# Altium schematic sheet EDU_High-Speed-Design_Power_3V0.SchDoc: 3V0
size 279 x 215 mm; Date: not used; ApprovedBy: not used; CheckedBy: not used; Author: not used; DrawnBy: not used; Organization: not used; Address4: not used; SheetNumber: 4; SheetTotal: 26; Time: not used; ImagePath: not used; Application_BuildNumber: not used
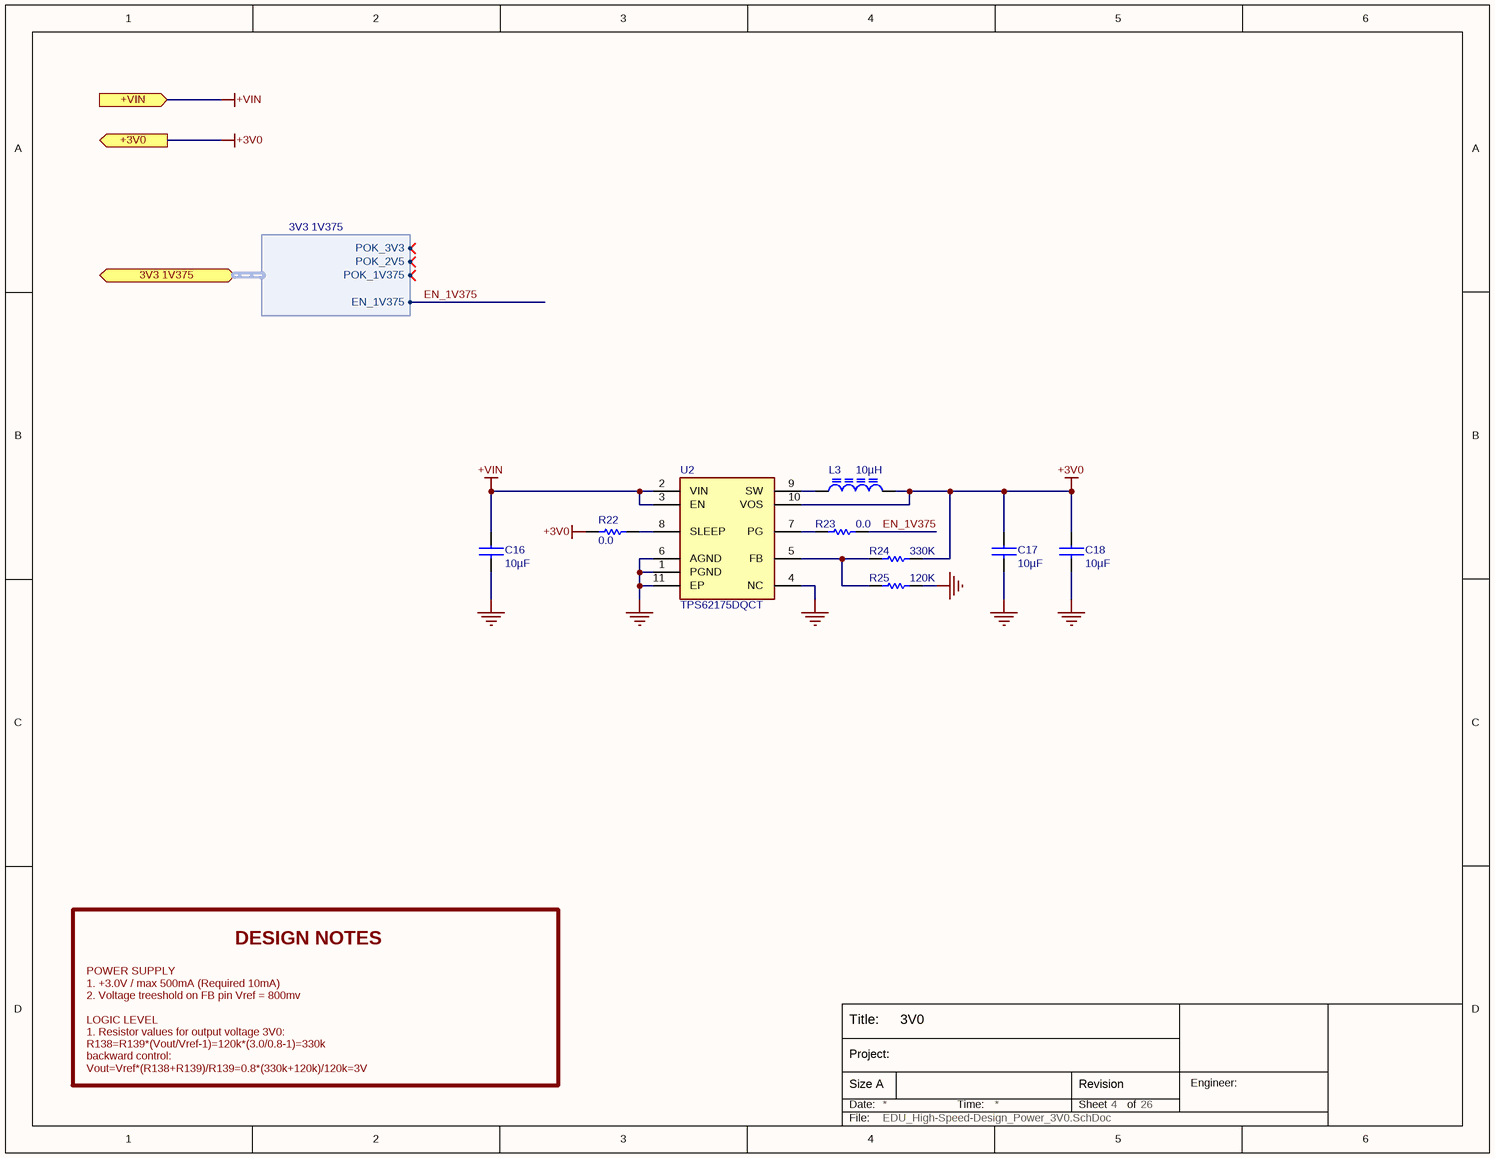
[diagram p0: EDU_High-Speed-Design_Power_3V0.SchDoc]

## Parts
C16  10µF  [C1206]
C17  10µF  [C0603]
C18  10µF  [C0603]
L3  10µH  [VLCF4020]
R22  0.0  [R0402]
R23  0.0  [R0402]
R24  330K  [R0402]
R25  120K  [R0402]
U2  TPS62175DQCT  [TPS62175DQCT]

## Ports
3V3 1V375 (bidir, harness 3V3 1V375), +3V0 (out), +VIN (in)

## Harnesses
3V3 1V375: POK_3V3, POK_1V375, POK_2V5, EN_1V375

## Nets
+3V0: C17.1 C18.1 L3.2 R22.1 R24.1 U2.10(VOS) ; port +3V0
+VIN: C16.1 U2.2(VIN) U2.3(EN) ; port +VIN
GND: C16.2 C17.2 C18.2 R25.1 U2.1(PGND) U2.4(NC) U2.6(AGND) U2.11(EP)
EN_1V375: R23.2 ; port 3V3 1V375.EN_1V375
NetL3_1: L3.1 U2.9(SW)
NetR22_2: R22.2 U2.8(SLEEP)
NetR23_1: R23.1 U2.7(PG)
NetR24_2: R24.2 R25.2 U2.5(FB)

## Notes on the sheet
- DESIGN NOTES
- POWER SUPPLY
  1. +3.0V / max 500mA (Required 10mA)
  2. Voltage treeshold on FB pin Vref = 800mv
  LOGIC LEVEL
  1. Resistor values for output voltage 3V0:
  R138=R139*(Vout/Vref-1)=120k*(3.0/0.8-1)=330k
  backward control:
  Vout=Vref*(R138+R139)/R139=0.8*(330k+120k)/120k=3V
- Title:
- Date:
- Size A
- Project:
- Time:
- Sheet
- Revision
- of
- Engineer:
- File:

## Library data of the parts
C16 = GRM31CR6YA106KA12L: CAP CER 10UF 35V X5R 1206; Manufacturer 1: Murata Electronics North America; Capacitance: 10µF; Manufacturer Part Number 1: GRM31CR6YA106KA12L; Supplier 1: Digi-Key; Supplier Part Number 1: 490-5524-1-ND; ComponentLink1URL: http://www.murata.com/products/catalog/pdf/c02e.pdf; ComponentLink1Description: http://www.murata.com/products/catalog/pdf/c02e.pdf; Voltage: 35V
C17 C18 = C1608X5R0J106M: CAP CER 10UF 6.3V X5R 20% 0603; Manufacturer 1: TDK Corporation; Capacitance: 10µF; Manufacturer Part Number 1: C1608X5R0J106M; Voltage: 6.3V; Supplier 1: Digi-Key; Supplier Part Number 1: 445-4112-1-ND; ComponentLink1URL: http://www.tdk.com/pdf/general_B11.pdf; ComponentLink1Description: http://www.tdk.com/pdf/general_B11.pdf
L3 = VLCF4020T-100MR85: INDUCTOR POWER 10UH .85A SMD; Manufacturer 1: TDK Corporation; Current Rating: 850mA; Supplier 1: Digi-Key; Manufacturer Part Number 1: VLCF4020T-100MR85; Inductance: 10µH; Current - Saturation: 850mA; ComponentLink1URL: http://www.tdk.co.jp/tefe02/e531_vlcf.pdf; ComponentLink1Description: http://www.tdk.co.jp/tefe02/e531_vlcf.pdf; Supplier Part Number 1: 445-3186-1-ND
R22 R23 = RC0402JR-070RL: RES 0.0 OHM 1/16W 0402 SMD; Manufacturer 1: Yageo; Manufacturer Part Number 1: RC0402JR-070RL; Resistance: 0.0; Supplier 1: Digi-Key; Supplier Part Number 1: 311-0.0JRCT-ND; ComponentLink1URL: http://www.yageo.com/documents/recent/PYu-RC0402_51_RoHS_L_6.pdf; ComponentLink1Description: http://www.yageo.com/documents/recent/PYu-RC0402_51_RoHS_L_6.pdf
R24 = CRCW0402330KFKED: RES 330K OHM 1/16W 1% 0402 SMD; Manufacturer 1: Vishay Dale; Supplier 1: Digi-Key; Supplier Part Number 1: 541-330KLCT-ND; Manufacturer Part Number 1: CRCW0402330KFKED; Resistance: 330K; ComponentLink1URL: http://www.vishay.com/doc?20035; ComponentLink1Description: http://www.vishay.com/doc?20035
R25 = RC0402FR-07120KL: RES 120K OHM 1/16W 1% 0402 SMD; Manufacturer 1: Yageo; Manufacturer Part Number 1: RC0402FR-07120KL; Resistance: 120K; Supplier 1: Digi-Key; Supplier Part Number 1: 311-120KLRCT-ND; ComponentLink1URL: http://www.yageo.com/documents/recent/PYu-RC0402_51_RoHS_L_6.pdf; ComponentLink1Description: http://www.yageo.com/documents/recent/PYu-RC0402_51_RoHS_L_6.pdf
U2 = TPS62175DQCT: IC REG BUCK SYNC ADJ 0.5A 10WSON; Manufacturer 1: Texas Instruments; Supplier 1: Digi-Key; Manufacturer Part Number 1: TPS62175DQCT; ComponentLink1URL: http://www.ti.com/lit/ds/symlink/tps62175.pdf; ComponentLink1Description: http://www.ti.com/lit/ds/symlink/tps62175.pdf; Supplier Part Number 1: 296-35096-1-ND